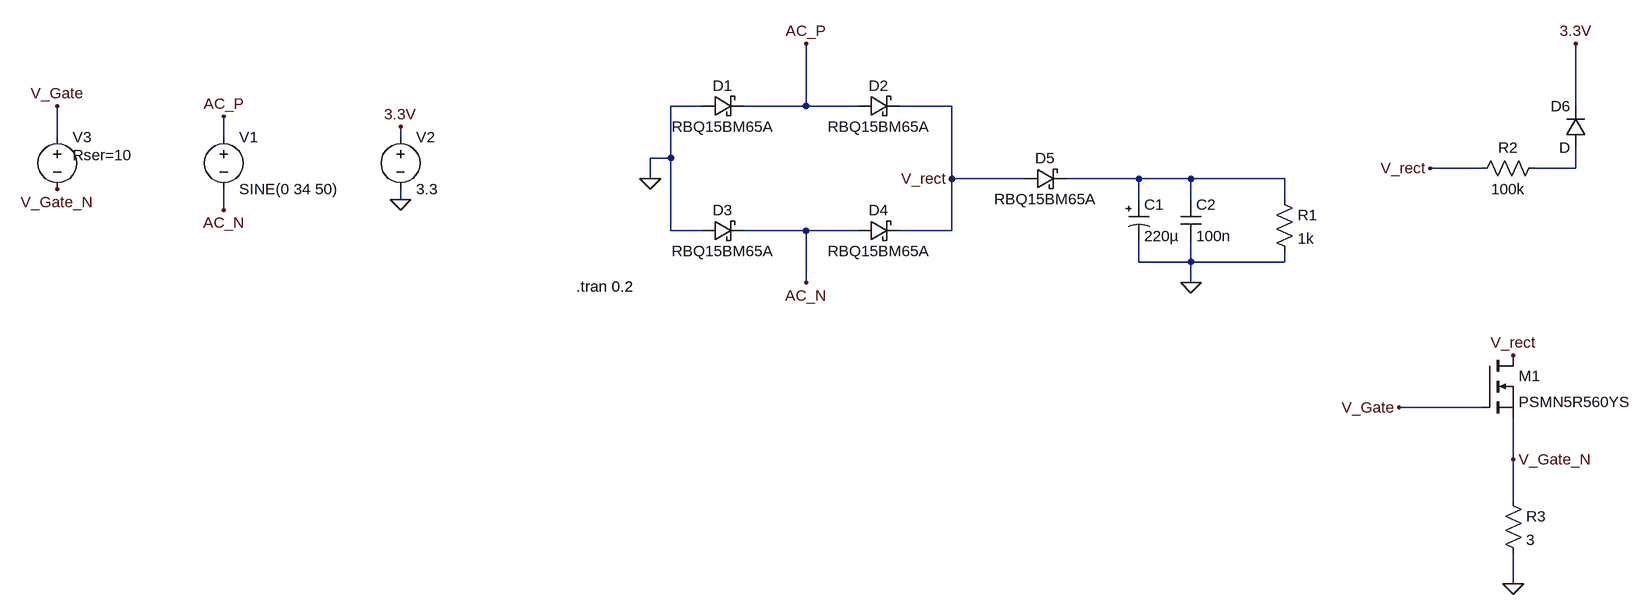
[diagram p0: schematic V_rect_sim.asc]
V_rect_sim.asc, the LTspice schematic file:
Version 4
SHEET 1 1560 804
WIRE 128 48 80 48
WIRE 288 48 288 -48
WIRE 288 48 192 48
WIRE 368 48 288 48
WIRE 512 48 432 48
WIRE 1472 48 1472 -48
WIRE -864 96 -864 48
WIRE -608 96 -608 64
WIRE -336 96 -336 80
WIRE 80 128 80 48
WIRE 80 128 48 128
WIRE 1328 144 1248 144
WIRE 1472 144 1472 112
WIRE 1472 144 1408 144
WIRE 48 160 48 128
WIRE 512 160 512 48
WIRE 624 160 512 160
WIRE 800 160 688 160
WIRE 880 160 800 160
WIRE 1024 160 880 160
WIRE -336 192 -336 176
WIRE 800 192 800 160
WIRE 880 192 880 160
WIRE 1024 192 1024 160
WIRE -608 208 -608 176
WIRE 80 240 80 128
WIRE 128 240 80 240
WIRE 288 240 192 240
WIRE 368 240 288 240
WIRE 512 240 512 160
WIRE 512 240 432 240
WIRE 800 288 800 256
WIRE 880 288 880 256
WIRE 880 288 800 288
WIRE 1024 288 1024 272
WIRE 1024 288 880 288
WIRE 288 320 288 240
WIRE 880 320 880 288
WIRE 1328 512 1200 512
WIRE 1376 592 1376 528
WIRE 1376 656 1376 592
WIRE 1376 784 1376 736
FLAG 48 160 0
FLAG 880 320 0
FLAG 512 160 V_rect
FLAG 1248 144 V_rect
FLAG -336 192 0
FLAG -336 80 3.3V
FLAG 1472 -48 3.3V
FLAG -608 64 AC_P
FLAG 288 -48 AC_P
FLAG -608 208 AC_N
FLAG 288 320 AC_N
FLAG -864 48 V_Gate
FLAG 1376 432 V_rect
FLAG 1376 784 0
FLAG 1200 512 V_Gate
FLAG -864 176 V_Gate_N
FLAG 1376 592 V_Gate_N
SYMBOL voltage -608 80 R0
WINDOW 123 0 0 Left 0
WINDOW 39 0 0 Left 0
SYMATTR InstName V1
SYMATTR Value SINE(0 34 50)
SYMBOL schottky 128 64 R270
WINDOW 0 32 32 VTop 2
WINDOW 3 0 32 VBottom 2
SYMATTR InstName D1
SYMATTR Value RBQ15BM65A
SYMATTR Description Diode
SYMATTR Type diode
SYMBOL schottky 368 64 R270
WINDOW 0 32 32 VTop 2
WINDOW 3 0 32 VBottom 2
SYMATTR InstName D2
SYMATTR Value RBQ15BM65A
SYMATTR Description Diode
SYMATTR Type diode
SYMBOL schottky 128 256 R270
WINDOW 0 32 32 VTop 2
WINDOW 3 0 32 VBottom 2
SYMATTR InstName D3
SYMATTR Value RBQ15BM65A
SYMATTR Description Diode
SYMATTR Type diode
SYMBOL schottky 368 256 R270
WINDOW 0 32 32 VTop 2
WINDOW 3 0 32 VBottom 2
SYMATTR InstName D4
SYMATTR Value RBQ15BM65A
SYMATTR Description Diode
SYMATTR Type diode
SYMBOL schottky 624 176 R270
WINDOW 0 32 32 VTop 2
WINDOW 3 0 32 VBottom 2
SYMATTR InstName D5
SYMATTR Value RBQ15BM65A
SYMATTR Description Diode
SYMATTR Type diode
SYMBOL polcap 784 192 R0
WINDOW 3 24 56 Left 2
SYMATTR InstName C1
SYMATTR Value 220µ
SYMATTR Description Capacitor
SYMATTR Type cap
SYMATTR SpiceLine V=50 Irms=920m Rser=0.08 Lser=0 mfg="Nichicon" pn="UPL1H221MRH6" type="Al electrolytic"
SYMBOL cap 864 192 R0
SYMATTR InstName C2
SYMATTR Value 100n
SYMATTR SpiceLine Rser=100m
SYMBOL res 1008 176 R0
SYMATTR InstName R1
SYMATTR Value 1k
SYMBOL res 1424 128 R90
WINDOW 0 0 56 VBottom 2
WINDOW 3 32 56 VTop 2
SYMATTR InstName R2
SYMATTR Value 100k
SYMBOL diode 1488 112 R180
WINDOW 0 24 64 Left 2
WINDOW 3 24 0 Left 2
SYMATTR InstName D6
SYMBOL voltage -336 80 R0
WINDOW 123 0 0 Left 0
WINDOW 39 0 0 Left 0
SYMATTR InstName V2
SYMATTR Value 3.3
SYMBOL voltage -864 80 R0
WINDOW 3 24 96 Invisible 2
WINDOW 123 0 0 Left 0
WINDOW 39 24 44 Left 2
SYMATTR InstName V3
SYMATTR Value PULSE(0 8 0 100u 50u 10m 20m)
SYMATTR SpiceLine Rser=10
SYMBOL nmos 1328 432 R0
SYMATTR InstName M1
SYMATTR Value PSMN5R560YS
SYMBOL res 1360 640 R0
SYMATTR InstName R3
SYMATTR Value 3
TEXT -66 326 Left 2 !.tran 0.2

The netlist it stands for:
* V_rect_sim.asc
V1 AC_P AC_N SINE(0 34 50)
D1 0 AC_P RBQ15BM65A
D2 AC_P V_rect RBQ15BM65A
D3 0 AC_N RBQ15BM65A
D4 AC_N V_rect RBQ15BM65A
D5 V_rect N002 RBQ15BM65A
C1 N002 0 220µ V=50 Irms=920m Rser=0.08 Lser=0 mfg="Nichicon" pn="UPL1H221MRH6" type="Al electrolytic"
C2 N002 0 100n Rser=100m
R1 N002 0 1k
R2 N001 V_rect 100k
D6 N001 3.3V D
V2 3.3V 0 3.3
V3 V_Gate V_Gate_N PULSE(0 8 0 100u 50u 10m 20m) Rser=10
M1 V_rect V_Gate V_Gate_N V_Gate_N PSMN5R560YS
R3 V_Gate_N 0 3
.model D D
.lib standard.dio
.model NMOS NMOS
.model PMOS PMOS
.lib standard.mos
.tran 0.2
.backanno
.end